# Altium schematic sheet OSSI-1 Interface Board_1.SchDoc: TITLE:
size 410 x 286 mm; Date: Date:; >LAST_DATE_TIME: 01/11/2015 13:33:59; Sheet:: Sheet:; >SHEET: 2; REV:: REV:; Document Number:: Document Number:; >DRAWING_NAME: OSSI-1 Interface Board.sch
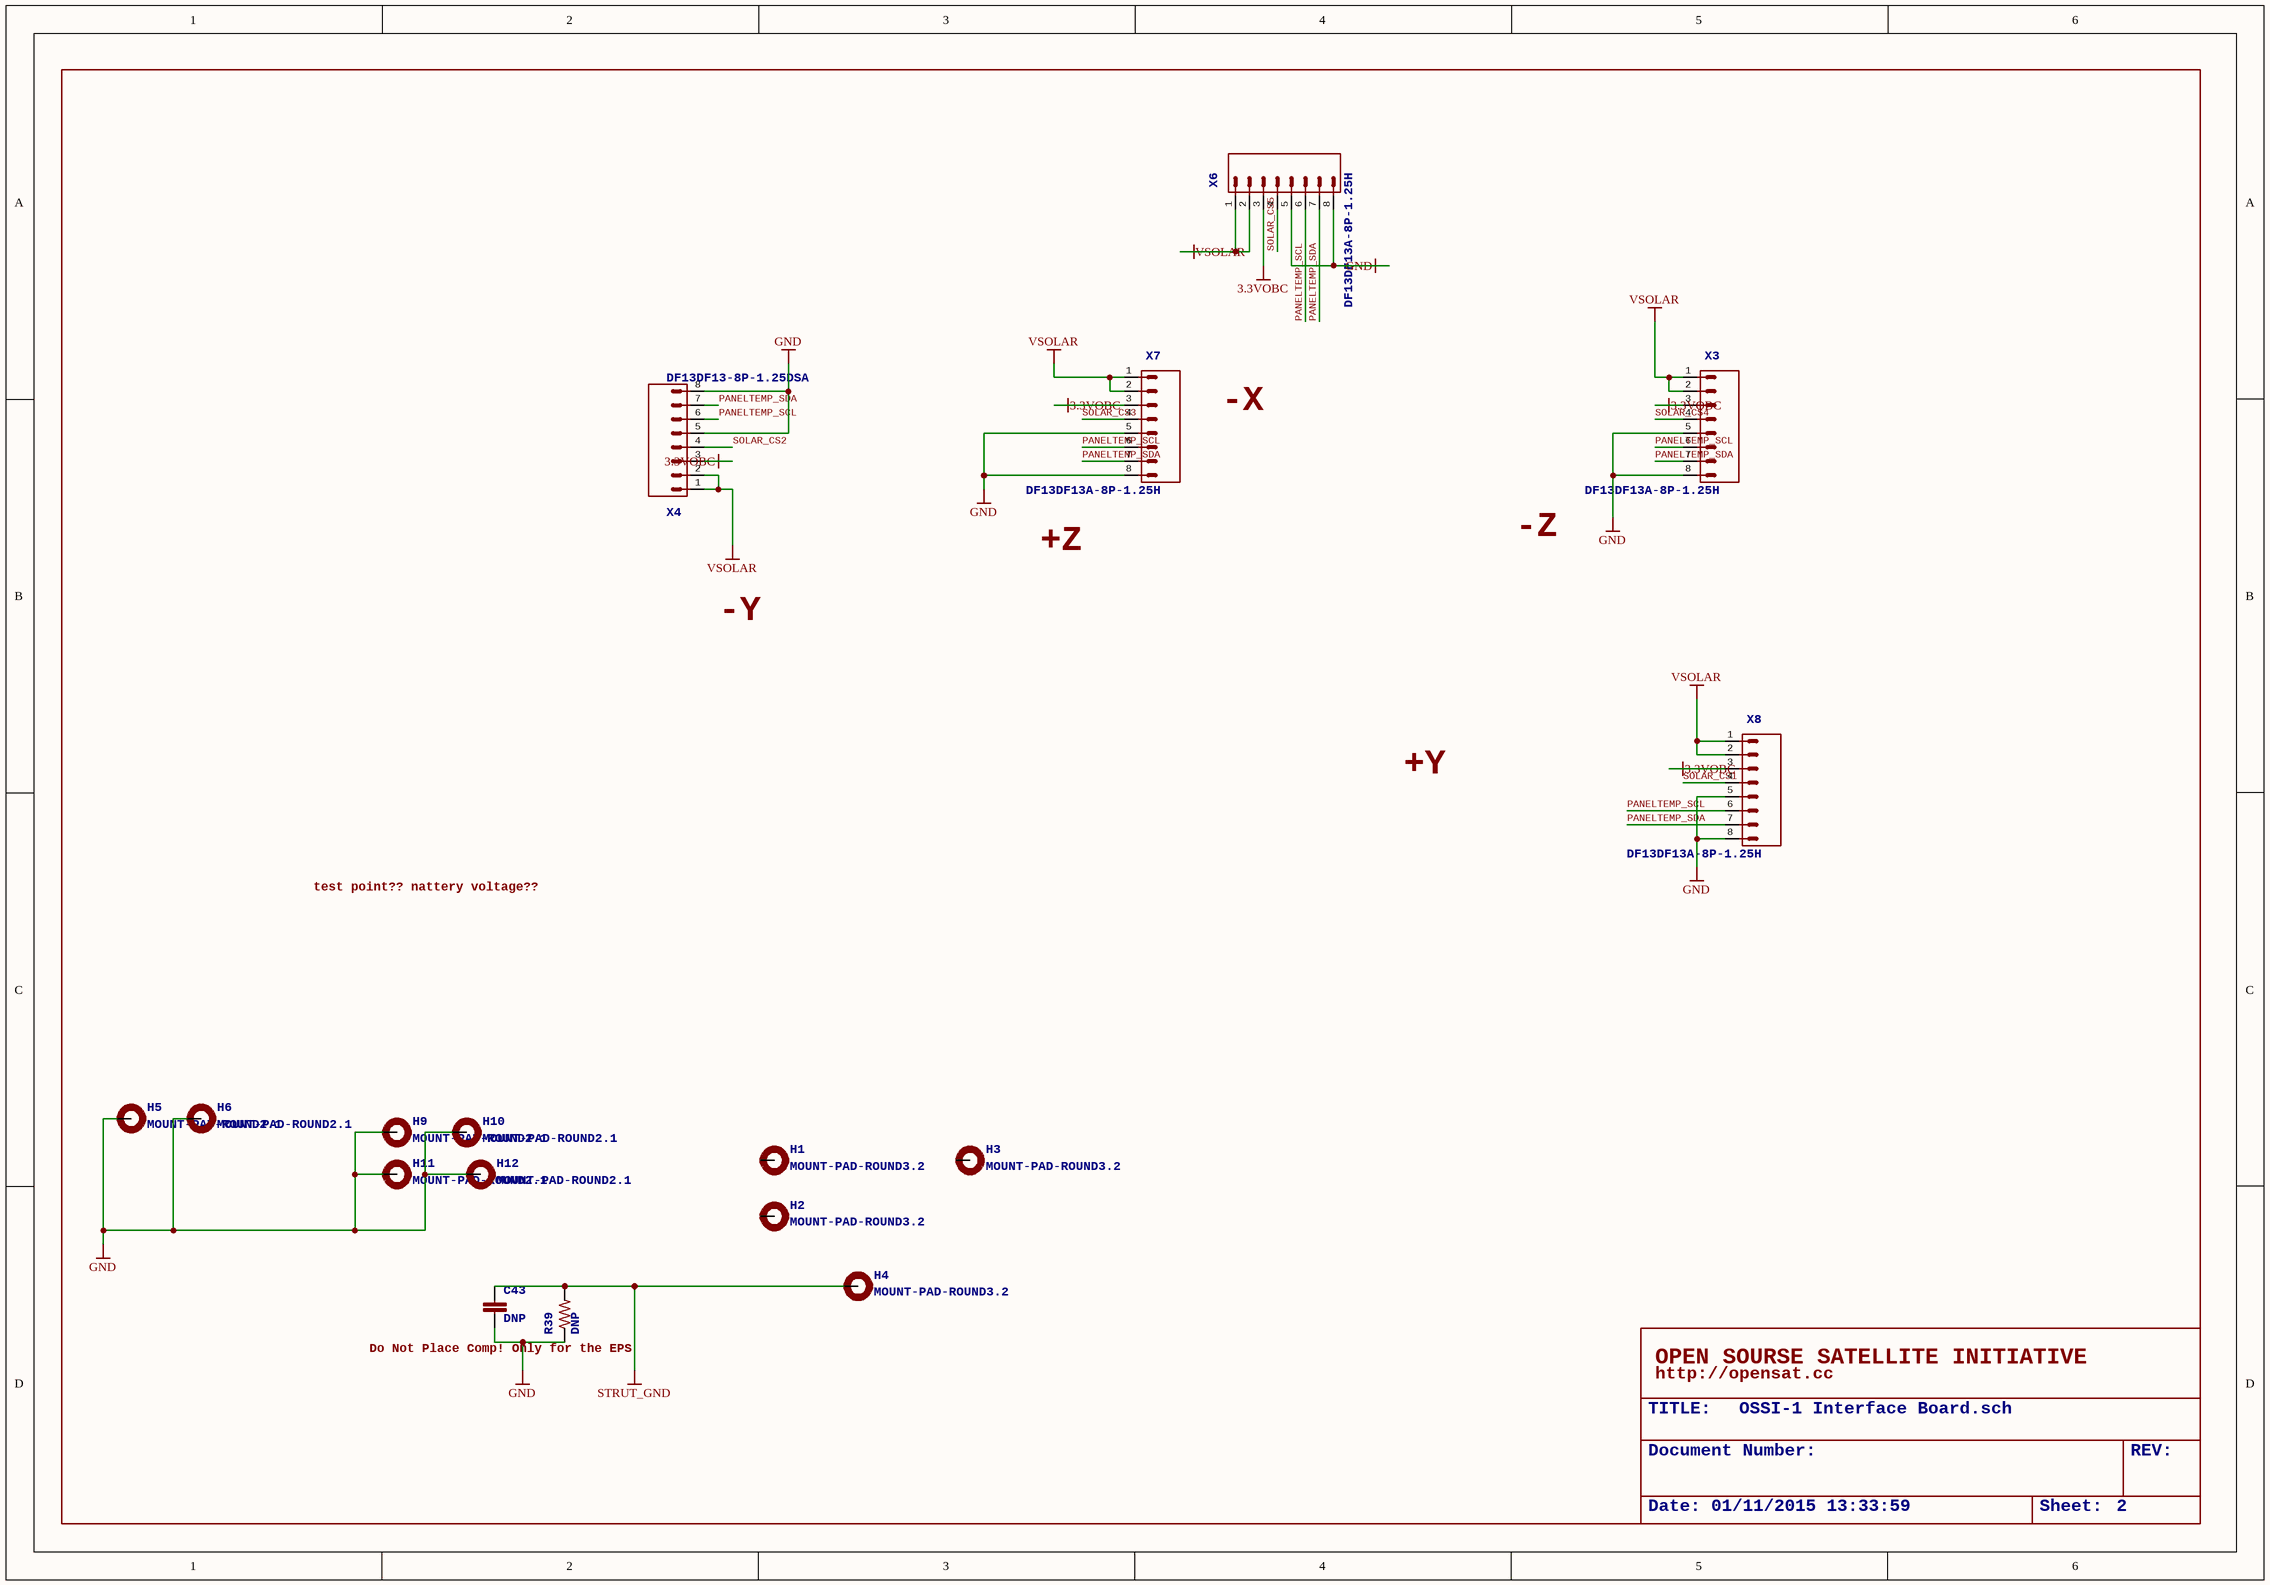
[diagram p0: OSSI-1 Interface Board_1.SchDoc]

## Parts
C43  >NAME: C43  [C0805(2012)]  (hidden comment: DNP)
H1  >NAME: H1  [3.2-PAD-ROUND]  (hidden comment: MOUNT-PAD-ROUND3.2)
H2  >NAME: H2  [3.2-PAD-ROUND]  (hidden comment: MOUNT-PAD-ROUND3.2)
H3  >NAME: H3  [3.2-PAD-ROUND]  (hidden comment: MOUNT-PAD-ROUND3.2)
H4  >NAME: H4  [3.2-PAD-ROUND]  (hidden comment: MOUNT-PAD-ROUND3.2)
H5  >NAME: H5  [2.1-PAD-ROUND]  (hidden comment: MOUNT-PAD-ROUND2.1)
H6  >NAME: H6  [2.1-PAD-ROUND]  (hidden comment: MOUNT-PAD-ROUND2.1)
H9  >NAME: H9  [2.1-PAD-ROUND]  (hidden comment: MOUNT-PAD-ROUND2.1)
H10  >NAME: H10  [2.1-PAD-ROUND]  (hidden comment: MOUNT-PAD-ROUND2.1)
H11  >NAME: H11  [2.1-PAD-ROUND]  (hidden comment: MOUNT-PAD-ROUND2.1)
H12  >NAME: H12  [2.1-PAD-ROUND]  (hidden comment: MOUNT-PAD-ROUND2.1)
R39  >NAME: R39  [WSL1206]  (hidden comment: DNP)
X3  >NAME: X3  [DF13A-8P]  (hidden comment: DF13DF13A-8P-1.25H)
X4  >NAME: X4  [DF13-8P-1.25DSA]  (hidden comment: DF13DF13-8P-1.25DSA)
X6  >NAME: X6  [DF13A-8P]  (hidden comment: DF13DF13A-8P-1.25H)
X7  >NAME: X7  [DF13A-8P]  (hidden comment: DF13DF13A-8P-1.25H)
X8  >NAME: X8  [DF13A-8P]  (hidden comment: DF13DF13A-8P-1.25H)

## Nets
3.3VOBC: X3.3 X4.3 X6.3 X7.3 X8.3
GND: C43.2 H5.B3,2(MOUNT) H6.B3,2(MOUNT) H9.B3,2(MOUNT) H10.B3,2(MOUNT) H11.B3,2(MOUNT) H12.B3,2(MOUNT) R39.P$1 X3.5 X3.8 X4.5 X4.8 X6.5 X6.8 X7.5 X7.8 X8.5 X8.8
STRUT_GND: C43.1 H4.B3,2(MOUNT) R39.P$2
VSOLAR: X3.1 X3.2 X4.1 X4.2 X6.1 X6.2 X7.1 X7.2 X8.1 X8.2
PANELTEMP_SCL: X3.6 X4.6 X6.6 X7.6 X8.6
PANELTEMP_SDA: X3.7 X4.7 X6.7 X7.7 X8.7
SOLAR_CS1: X8.4
SOLAR_CS2: X4.4
SOLAR_CS3: X7.4
SOLAR_CS4: X3.4
SOLAR_CS5: X6.4

Not connected (* = marked no-connect by the designer): H1 B3,2(MOUNT); H2 B3,2(MOUNT); H3 B3,2(MOUNT)

## Notes on the sheet
- -X
- +Z
- -Z
- -Y
- +Y
- test point?? nattery voltage??
- (near R39) Do Not Place Comp! Only for the EPS
- OPEN SOURSE SATELLITE INITIATIVE
- http://opensat.cc

## Library data of the parts
C43 = C0805(2012): >VALUE: DNP
R39 = RWSL1206: >VALUE: DNP
X3 X6-X8 = DF13DF13A-8P-1.25H: Hirose DF13 series connector; >VALUE: DF13DF13A-8P-1.25H
X4 = DF13DF13-8P-1.25DSA: Hirose DF13 series connector; >VALUE: DF13DF13-8P-1.25DSA
H1-H4 = MOUNT-PAD-ROUND3.2: >VALUE: MOUNT-PAD-ROUND3.2
H5 H6 H9-H12 = MOUNT-PAD-ROUND2.1: >VALUE: MOUNT-PAD-ROUND2.1